# EAGLE design PWA_1_0 (EAGLE 8.3.2)
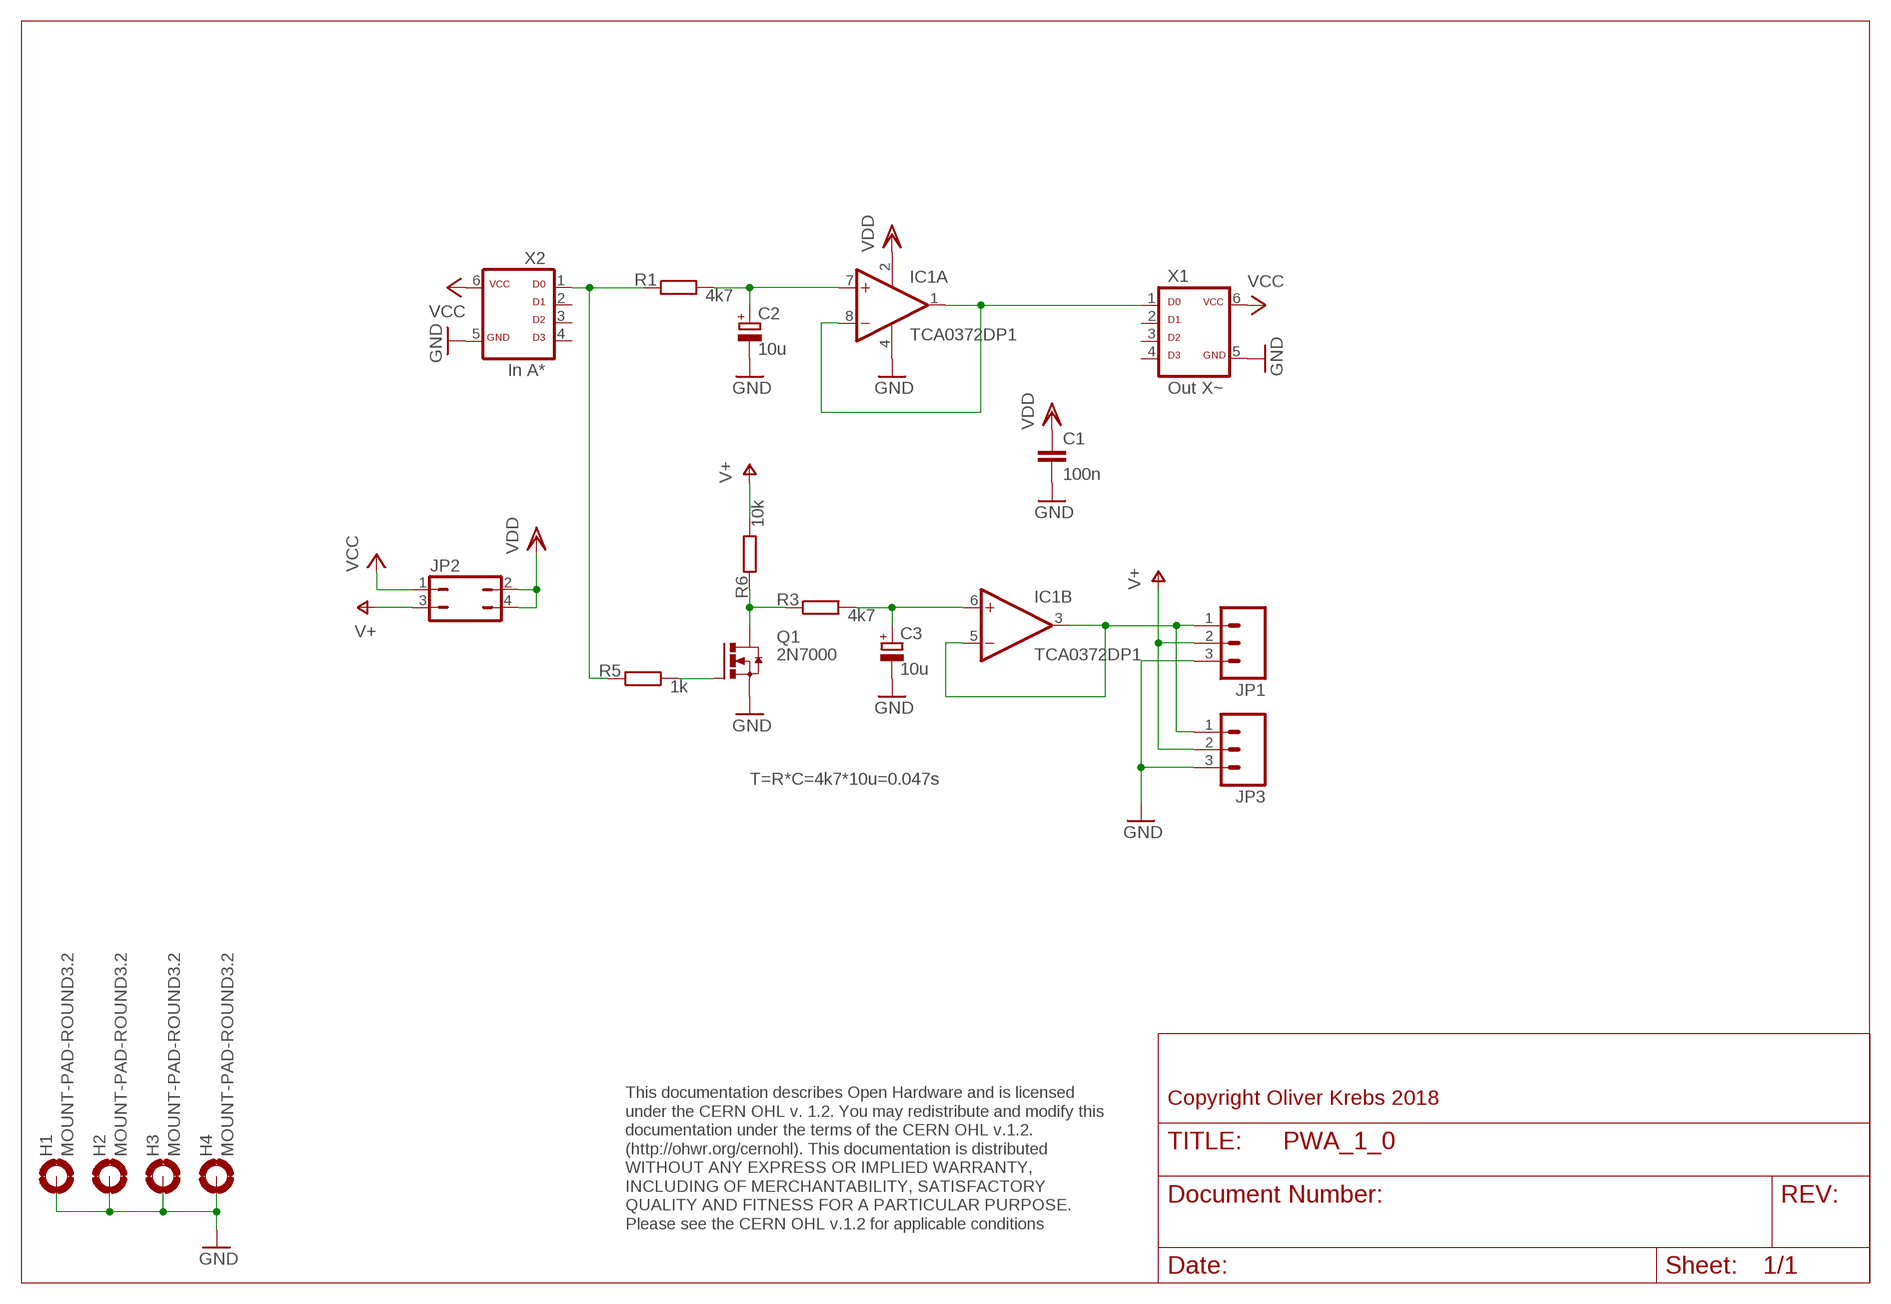
[diagram p0: schematic, sheet 1]

## Parts
C1  100n  C-EU050-025X075  [C050-025X075]
C2  10u  CPOL-EUE2-4  [E2-4]
C3  10u  CPOL-EUE2-4  [E2-4]
H1  MOUNT-PAD-ROUND3.2  [3,2-PAD]
H2  MOUNT-PAD-ROUND3.2  [3,2-PAD]
H3  MOUNT-PAD-ROUND3.2  [3,2-PAD]
H4  MOUNT-PAD-ROUND3.2  [3,2-PAD]
IC1  TCA0372DP1  [DIL08]
JP1  M03PTH  [1X03]
JP2  JP2Q  [JP2Q]
JP3  M03BIG_5.08  [1X03_BIG_5.08]
Q1  2N7000  [TO92-LINE]
R1  4k7  R-EU_0207/10  [0207/10]
R3  4k7  R-EU_0207/10  [0207/10]
R5  1k  R-EU_0207/10  [0207/10]
R6  10k  R-EU_0207/10  [0207/10]
X1  Out X~  ML6D  [ML-6]
X2  In A*  ML6D  [ML-6]

## Nets
GND: C1.2 C2.- C3.- H1.B3,2(MOUNT) H2.B3,2(MOUNT) H3.B3,2(MOUNT) H4.B3,2(MOUNT) IC1.4(GND) JP1.3 JP3.3 Q1.3(S) X1.5 X2.5
N$1: C2.+ IC1.7(A:+IN) R1.2
N$2: IC1.1(A:OUT) IC1.8(A:-IN) X1.1
N$3: R1.1 R5.1 X2.1
N$4: IC1.3(B:OUT) IC1.5(B:-IN) JP1.1 JP3.1
N$5: C3.+ IC1.6(B:+IN) R3.2
N$8: Q1.1(D) R3.1 R6.1
N$9: Q1.2(G) R5.2
V+: JP1.2 JP2.3 JP3.2 R6.2
VCC: JP2.1 X1.6 X2.6
VDD: C1.1 IC1.2(VDD) JP2.2 JP2.4
Unconnected: X1.2 X1.3 X1.4 X2.2 X2.3 X2.4

## Notes on the sheet
- T=R*C=4k7*10u=0.047s
- Copyright Oliver Krebs 2018
- This documentation describes Open Hardware and is licensed 
  under the CERN OHL v. 1.2. You may redistribute and modify this 
  documentation under the terms of the CERN OHL v.1.2. 
  (http://ohwr.org/cernohl). This documentation is distributed
  WITHOUT ANY EXPRESS OR IMPLIED WARRANTY, 
  INCLUDING OF MERCHANTABILITY, SATISFACTORY 
  QUALITY AND FITNESS FOR A PARTICULAR PURPOSE. 
  Please see the CERN OHL v.1.2 for applicable conditions

## Library data of the parts
C1 = 01-my_rcl:C-EU: CAPACITOR, European symbol
C2 C3 = 01-my_rcl:CPOL-EU: POLARIZED CAPACITOR, European symbol
H1-H4 = holes:MOUNT-PAD-ROUND: MOUNTING PAD, round
IC1 = 01-my-linear:TCA0372: Dual Power Operational Amplifier Output Current to 1.0 A Vcc-0,8V Vee+0,8V @0,1A 30V Vcc-1,3V Vee+1,3V @1A 24V
JP1 JP3 = SparkFun-Connectors:M03: Header 3 Standard 3-pin 0.1" header. Use with straight break away headers (SKU : PRT-00116), right angle break away headers (PRT-00553), swiss pins (PRT-00743), machine pins (PRT-00117), and female headers (PRT-00115). Molex polarized connector foot print use with SKU : PRT-08232 with associated crimp pins and housings.
JP2 = 01-my-jumper:JP2Q: JUMPER
Q1 = 01-my-transistor:2N7000
R1 R3 R5 R6 = 01-my_rcl:R-EU_: RESISTOR, European symbol
X1 X2 = 01-my-con:ML6D

## Board
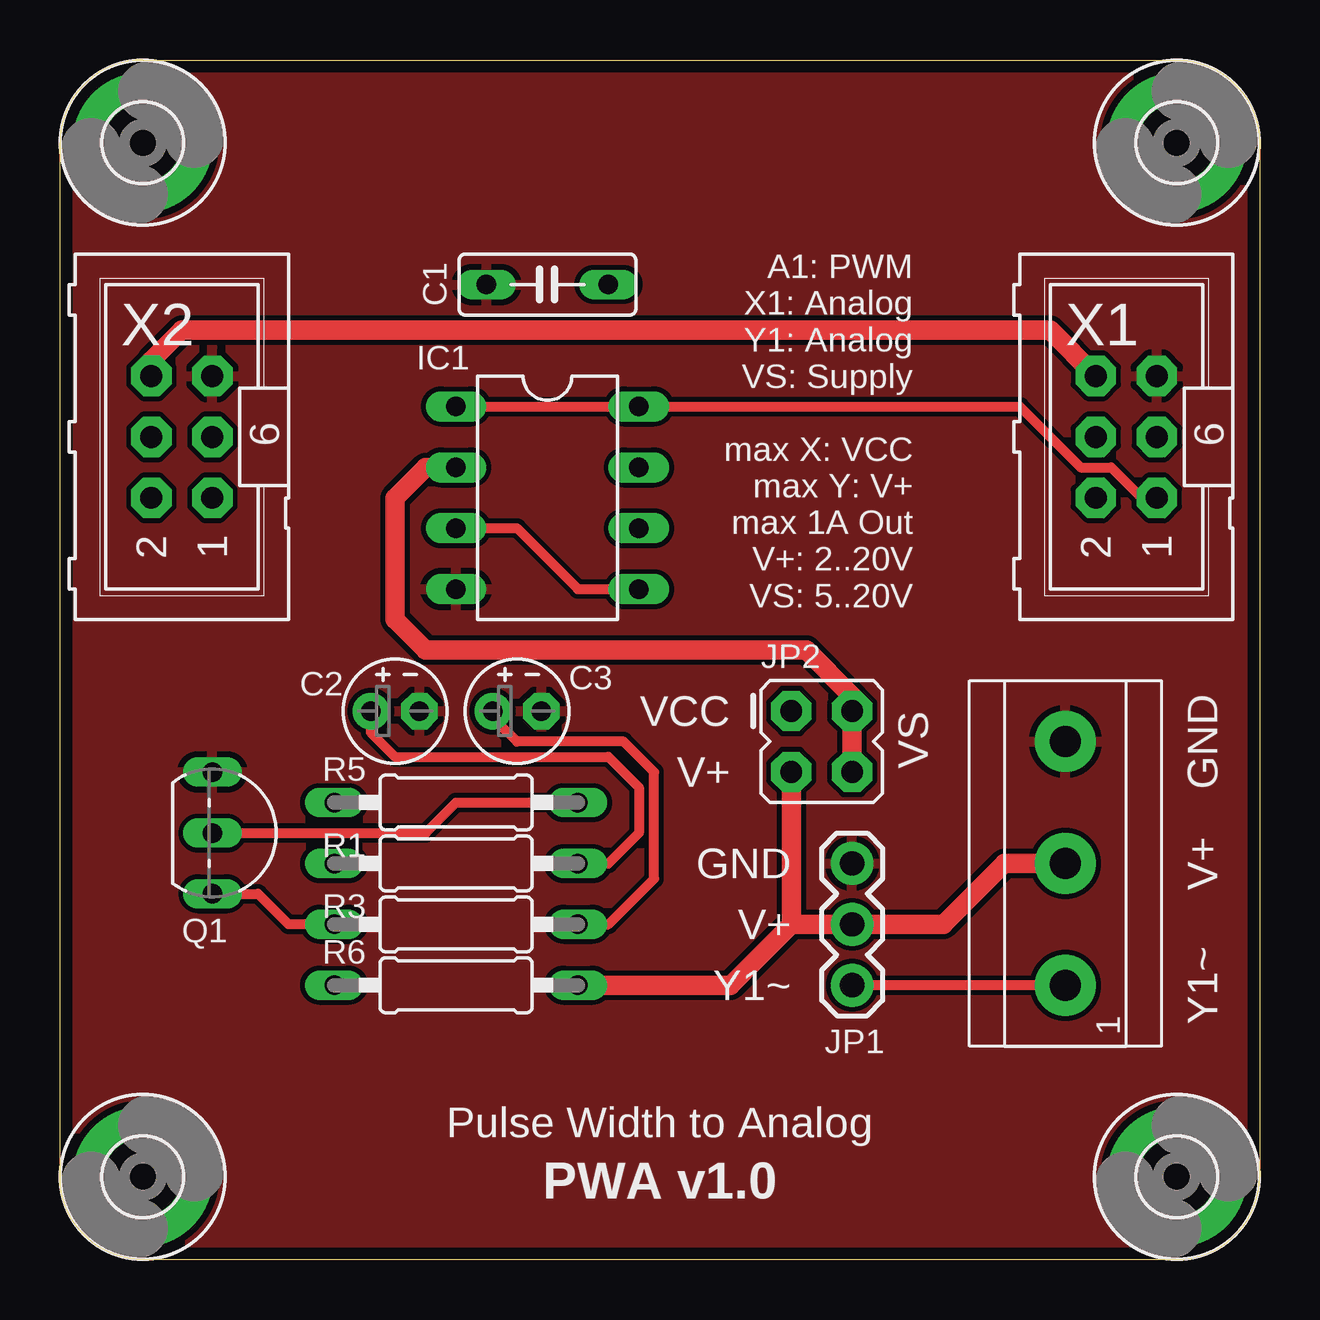
[diagram p1: board, top side]
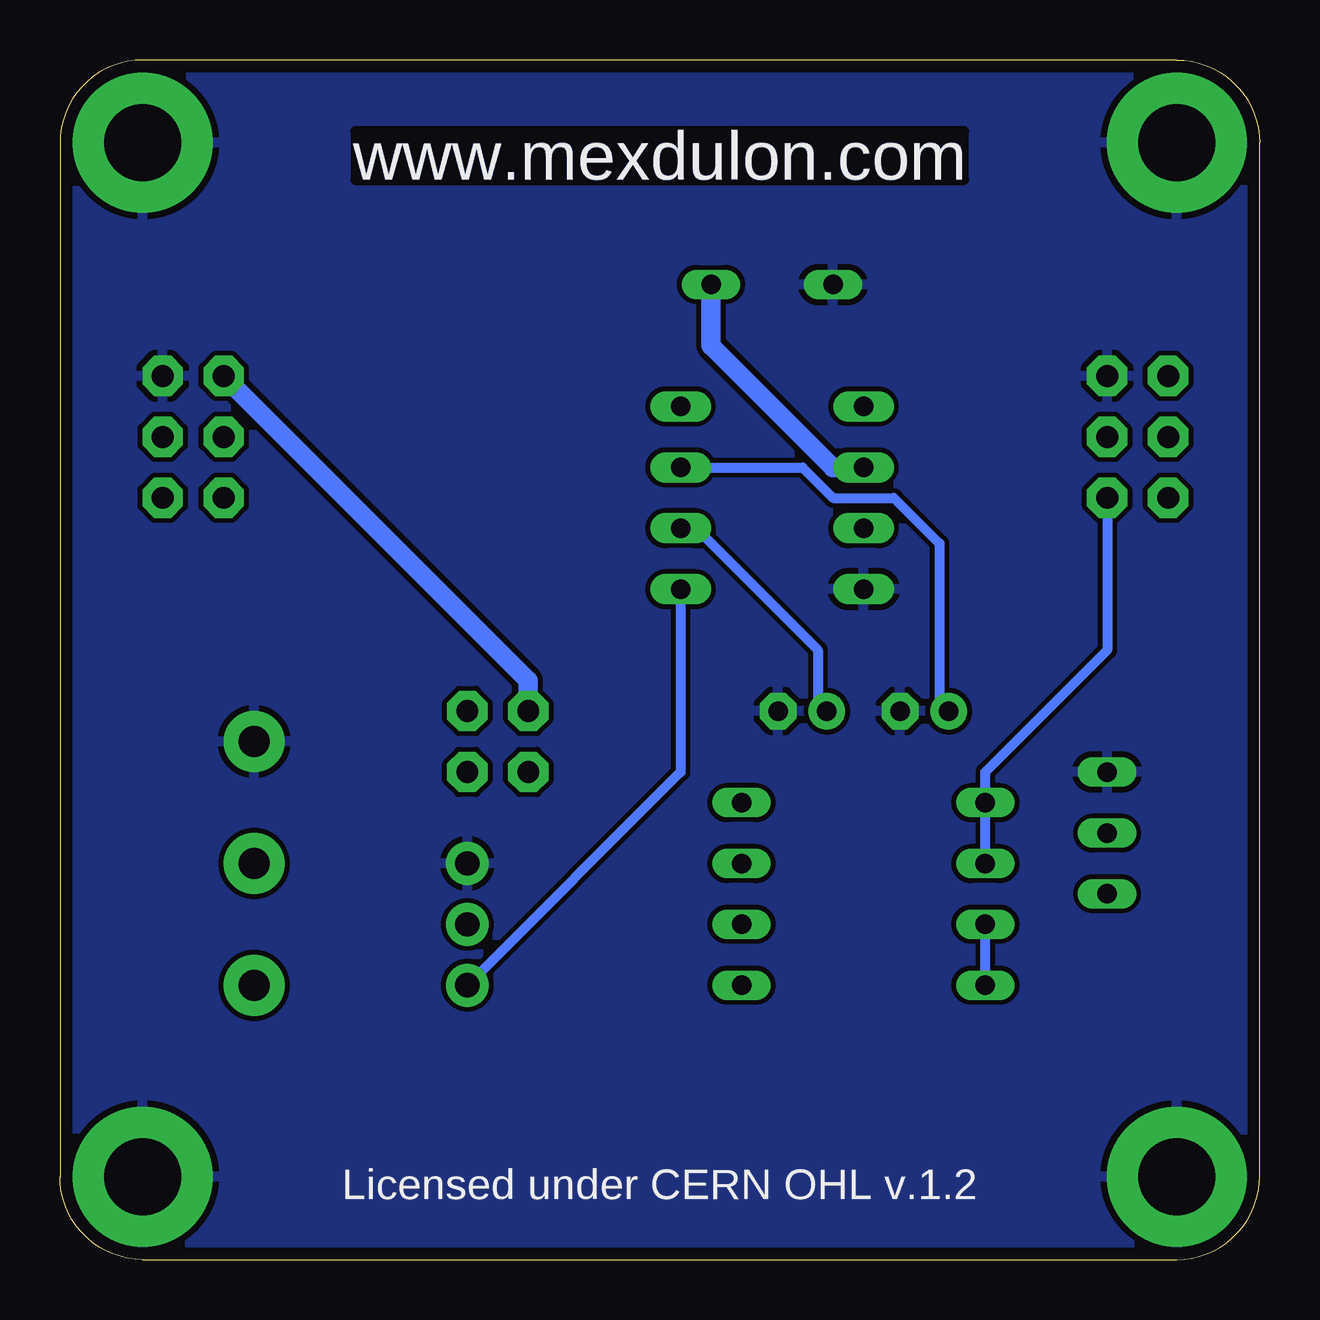
[diagram p2: board, bottom side, seen from below]

Size 50 x 50 mm. Coordinates in mm from the lower left corner, seen from the top.
Outline: 0,3.45 0,46.55 arc-90 3.45,50 46.55,50 arc-90 50,46.55 50,3.45 arc-90 46.55,0 3.45,0 arc-90 0,3.45
Copper layers (1*16): Top 0.035mm / dielectric 1.6mm / Bottom 0.035mm
Design rules "Elecrow_2-layer_PCB_eagle_rule": minimum track width 6mil, minimum drill 12mil, track to track 6mil, track to pad 6mil, pad to pad 6mil, via to via 8mil, smd to smd 0mil, copper to edge 20mil, drill to drill 10mil, minimum pad ring 6mil, minimum via ring 6mil, stop-mask expansion 0mil, vias tented up to drill 100mil, thermal gap 10mil

### Footprints (pad centres in the part's own frame; a part is rotated, then mirrored left to right if it is on the bottom)
C050-025X075 = drill 0.813 long: 1 -2.54,0; 2 2.54,0
E2-4 = drill 0.813 pad 1.524: + -1.016,0 | drill 0.813 pad 1.524 octagon: - 1.016,0
3,2-PAD = drill 3.2 pad 5.842: B3,2 0,0
DIL08 = drill 0.813 pad 1.27 long: 1 -3.81,-3.81; 2 -1.27,-3.81; 3 1.27,-3.81; 4 3.81,-3.81; 5 3.81,3.81; 6 1.27,3.81; 7 -1.27,3.81; 8 -3.81,3.81
1X03 = drill 1.016 pad 1.778: 1 0,0; 2 2.54,0; 3 5.08,0
JP2Q = drill 0.914 pad 1.676 octagon: 1 -1.27,-1.27; 2 -1.27,1.27; 3 1.27,-1.27; 4 1.27,1.27
1X03_BIG_5.08 = drill 1.3 pad 2.54: 1 -5.08,0; 2 0,0; 3 5.08,0
TO92-LINE = drill 0.813 long: 1 2.54,0; 2 0,0; 3 -2.54,0
0207/10 = drill 0.813 long: 1 -5.08,0; 2 5.08,0
ML-6 = drill 0.914 pad 1.676 octagon: 1 -2.54,-1.27; 2 -2.54,1.27; 3 0,-1.27; 4 0,1.27; 5 2.54,-1.27; 6 2.54,1.27

### Placement (x,y rotation side)
C1  20.32,40.64 180 top
C2  13.97,22.86 0 top
C3  19.05,22.86 0 top
H1  3.45,3.45 0 top
H2  3.45,46.55 0 top
H3  46.55,46.55 0 top
H4  46.55,3.45 0 top
IC1  20.32,31.75 270 top
JP1  33.02,11.43 90 top
JP2  31.75,21.59 270 top
JP3  41.91,16.51 90 top
Q1  6.35,17.78 270 top
R1  16.51,16.51 0 top
R3  16.51,13.97 0 top
R5  16.51,19.05 0 top
R6  16.51,11.43 0 top
X1  44.45,34.29 90 top
X2  5.08,34.29 90 top

### Tracks (layer width: path | path; a pad name or v marks a point on that pad's centre or on a via)
GND
  pour Bottom (isolate 0.203): 0,50.16 50.8,50.16 50.8,0 0,0
  pour Top (isolate 0.203): 0,50.16 50.8,50.16 50.8,0 0,0
N$1
  Top 0.406: C2.+ 12.95,21.97 13.97,20.95 22.86,20.95 24.13,19.68 24.13,17.78 22.86,16.51 R1.2
  Bottom 0.406: IC1.7 19.05,33.02 17.78,31.75 15.24,31.75 13.34,29.84 13.34,23.24 C2.+
N$2
  Top 0.406: IC1.1 IC1.8 40.01,35.56 42.55,33.02 43.81,33.02 45.09,31.75 X1.1
N$3
  Bottom 0.406: X2.1 6.35,25.4 11.43,20.32 R5.1 R1.1
N$4
  Top 0.406: JP3.1 JP1.1 | IC1.3 19.05,30.48 21.59,27.94 IC1.5
  Bottom 0.406: IC1.5 24.13,20.32 JP1.1
N$5
  Top 0.406: R3.2 22.86,13.97 24.77,15.88 24.77,20.32 23.5,21.59 19.05,21.59 18.41,22.23 18.41,22.48 C3.+
  Bottom 0.406: IC1.6 23.5,30.48 18.41,25.4 18.41,23.24 C3.+
N$8
  Top 0.406: Q1.1 8.26,15.24 9.53,13.97 R3.1
  Bottom 0.406: R6.1 R3.1
N$9
  Top 0.406: Q1.2 15.24,17.78 16.51,19.05 R5.2
V+
  Top 0.813: JP3.2 39.37,16.51 36.83,13.97 JP1.2 30.48,13.97 | 30.48,13.97 27.94,11.43 R6.2 | JP2.3 30.48,13.97
VCC
  Top 0.813: X2.6 3.81,37.47 5.08,38.73 41.27,38.73 X1.6
  Bottom 0.813: JP2.1 30.48,24.13 X1.6
VDD
  Top 0.813: JP2.4 JP2.2 33.02,23.5 31.11,25.4 15.24,25.4 13.97,26.67 13.97,31.75 15.24,33.02 IC1.2
  Bottom 0.813: C1.1 22.86,38.1 17.78,33.02 IC1.2

### Text on the board
Bottom: www.mexdulon.com
tNames: A1: PWM / X1: Analog / Y1: Analog / VS: Supply / / max X: VCC / max Y: V+ / max 1A Out / V+: 2..20V / VS: 5..20V | VCC | VS | GND | V+ | GND | V+ | V+ | Y1~ | Y1~ | Pulse Width to Analog | PWA v1.0
bNames: www.mexdulon.com | Licensed under CERN OHL v.1.2
200bmp: E:/Bilder/Elektronik/Modulion/Mexdulon/mexdulon_50x50_pcb.bmp